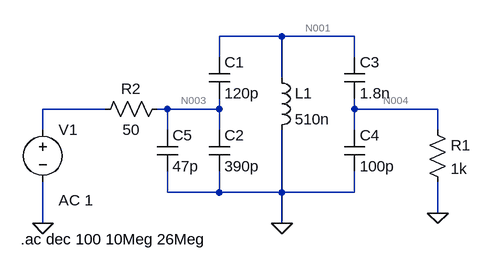
[diagram p0: schematic acopleLC.asc]
acopleLC.asc, the LTspice schematic file:
Version 4
SHEET 1 880 680
WIRE -48 32 -144 32
WIRE 64 32 -48 32
WIRE -144 64 -144 32
WIRE 64 64 64 32
WIRE -48 96 -48 32
WIRE -320 144 -416 144
WIRE -224 144 -240 144
WIRE -144 144 -144 128
WIRE -144 144 -224 144
WIRE 64 144 64 128
WIRE 192 144 64 144
WIRE -416 176 -416 144
WIRE -224 176 -224 144
WIRE -144 176 -144 144
WIRE 64 176 64 144
WIRE 192 176 192 144
WIRE -224 272 -224 240
WIRE -144 272 -144 240
WIRE -144 272 -224 272
WIRE -48 272 -48 176
WIRE -48 272 -144 272
WIRE 64 272 64 240
WIRE 64 272 -48 272
WIRE 192 304 192 256
WIRE -416 320 -416 256
WIRE -48 320 -48 272
FLAG 192 304 0
FLAG -48 320 0
FLAG -416 320 0
SYMBOL ind -64 80 R0
SYMATTR InstName L1
SYMATTR Value 510n
SYMBOL cap -160 64 R0
SYMATTR InstName C1
SYMATTR Value 120p
SYMBOL cap -160 176 R0
SYMATTR InstName C2
SYMATTR Value 390p
SYMBOL cap 48 64 R0
SYMATTR InstName C3
SYMATTR Value 1.8n
SYMBOL cap 48 176 R0
SYMATTR InstName C4
SYMATTR Value 100p
SYMBOL res 176 160 R0
SYMATTR InstName R1
SYMATTR Value 1k
SYMBOL res -224 128 R90
WINDOW 0 0 56 VBottom 2
WINDOW 3 32 56 VTop 2
SYMATTR InstName R2
SYMATTR Value 50
SYMBOL voltage -416 160 R0
WINDOW 123 24 124 Left 2
WINDOW 39 0 0 Left 0
SYMATTR InstName V1
SYMATTR Value ""
SYMATTR Value2 AC 1
SYMBOL cap -240 176 R0
SYMATTR InstName C5
SYMATTR Value 47p
TEXT -450 344 Left 2 !.ac dec 100 10Meg 26Meg

The netlist it stands for:
* acopleLC.asc
L1 N001 0 510n
C1 N001 N003 120p
C2 N003 0 390p
C3 N001 N004 1.8n
C4 N004 0 100p
R1 N004 0 1k
R2 N003 N002 50
V1 N002 0 AC 1
C5 N003 0 47p
.ac dec 100 10Meg 26Meg
.backanno
.end

* Results of the author's LTspice run, read from the files saved beside the schematic
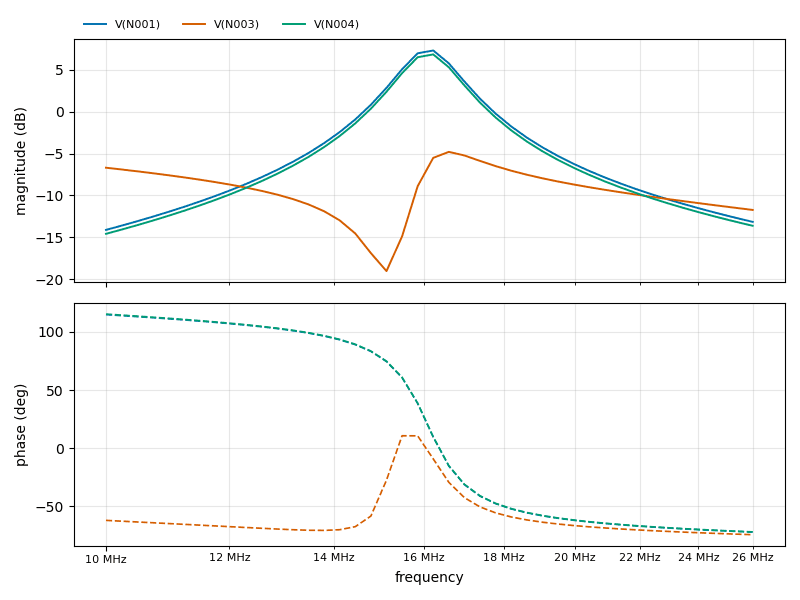
[diagram p1: AC Analysis of acopleLC.asc, plotted from the saved traces]
* AC Analysis, 1 run:
*   V(N001): -14.11 dB at 10 MHz, -13.15 dB at 26 MHz, peak 7.32 dB at 16.22 MHz, 3 dB below the peak at 15.37 MHz and 16.86 MHz
*   V(N003): -6.69 dB at 10 MHz, -11.73 dB at 26 MHz, peak -4.79 dB at 16.6 MHz, 3 dB below the peak at 15.97 MHz and 18.91 MHz
*   V(N004): -14.58 dB at 10 MHz, -13.62 dB at 26 MHz, peak 6.85 dB at 16.22 MHz, 3 dB below the peak at 15.37 MHz and 16.86 MHz